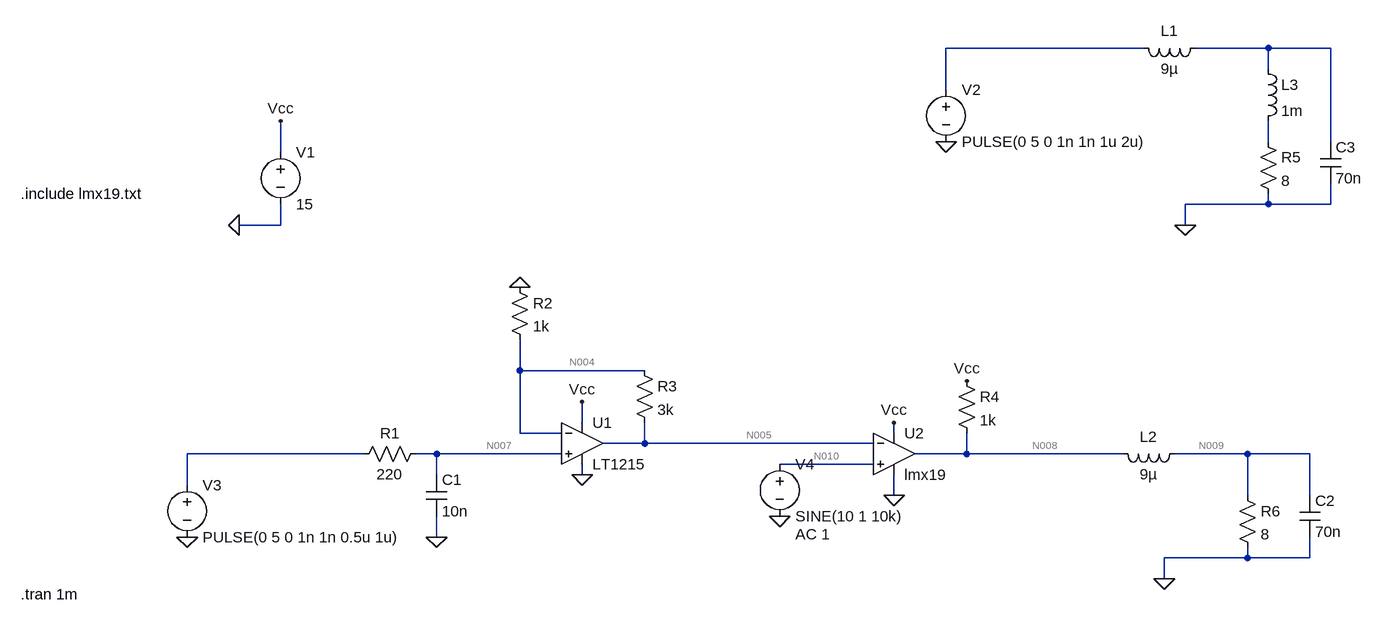
[diagram p0: schematic Entrada-micro-1Mhz - Kopie.asc]
Entrada-micro-1Mhz - Kopie.asc, the LTspice schematic file:
Version 4
SHEET 1 3020 900
WIRE 2272 -288 1968 -288
WIRE 2464 -288 2352 -288
WIRE 2560 -288 2464 -288
WIRE 2464 -256 2464 -288
WIRE 1968 -224 1968 -288
WIRE 2464 -144 2464 -176
WIRE 2560 -144 2560 -288
WIRE 944 -128 944 -176
WIRE 2464 -48 2464 -64
WIRE 2464 -48 2336 -48
WIRE 2560 -48 2560 -80
WIRE 2560 -48 2464 -48
WIRE 944 -16 944 -48
WIRE 944 -16 880 -16
WIRE 2336 -16 2336 -48
WIRE 1312 208 1312 160
WIRE 1504 208 1312 208
WIRE 1408 288 1408 256
WIRE 1312 304 1312 208
WIRE 1376 304 1312 304
WIRE 1888 304 1888 288
WIRE 1504 320 1504 288
WIRE 1504 320 1440 320
WIRE 1856 320 1504 320
WIRE 1072 336 800 336
WIRE 1184 336 1152 336
WIRE 1376 336 1184 336
WIRE 2000 336 2000 304
WIRE 2000 336 1920 336
WIRE 2240 336 2000 336
WIRE 2432 336 2320 336
WIRE 2528 336 2432 336
WIRE 1856 352 1712 352
WIRE 1184 368 1184 336
WIRE 1408 368 1408 352
WIRE 800 384 800 336
WIRE 1888 400 1888 368
WIRE 2432 400 2432 336
WIRE 2528 400 2528 336
WIRE 1184 464 1184 432
WIRE 2432 496 2432 480
WIRE 2432 496 2304 496
WIRE 2528 496 2528 464
WIRE 2528 496 2432 496
WIRE 2304 528 2304 496
FLAG 880 -16 0
FLAG 944 -176 Vcc
FLAG 800 464 0
FLAG 1184 464 0
FLAG 1312 80 0
FLAG 1408 368 0
FLAG 1408 256 Vcc
FLAG 1888 288 Vcc
FLAG 1712 432 0
FLAG 2000 224 Vcc
FLAG 2304 528 0
FLAG 1888 400 0
FLAG 2336 -16 0
FLAG 1968 -144 0
SYMBOL voltage 944 -144 R0
SYMATTR InstName V1
SYMATTR Value 15
SYMBOL voltage 800 368 R0
WINDOW 123 0 0 Left 2
WINDOW 39 0 0 Left 2
SYMATTR InstName V3
SYMATTR Value PULSE(0 5 0 1n 1n 0.5u 1u)
SYMBOL res 1168 320 R90
WINDOW 0 0 56 VBottom 2
WINDOW 3 32 56 VTop 2
SYMATTR InstName R1
SYMATTR Value 220
SYMBOL cap 1168 368 R0
SYMATTR InstName C1
SYMATTR Value 10n
SYMBOL res 1296 64 R0
SYMATTR InstName R2
SYMATTR Value 1k
SYMBOL res 1488 192 R0
SYMATTR InstName R3
SYMATTR Value 3k
SYMBOL Opamps\\LT1215 1408 256 R0
SYMATTR InstName U1
SYMBOL Opamps\\opamp2 1888 272 R0
SYMATTR InstName U2
SYMATTR Value lmx19
SYMBOL voltage 1712 336 R0
WINDOW 123 24 124 Left 2
WINDOW 39 0 0 Left 2
SYMATTR Value2 AC 1
SYMATTR InstName V4
SYMATTR Value SINE(10 1 10k)
SYMBOL res 1984 208 R0
SYMATTR InstName R4
SYMATTR Value 1k
SYMBOL ind 2336 320 R90
WINDOW 0 5 56 VBottom 2
WINDOW 3 32 56 VTop 2
SYMATTR InstName L2
SYMATTR Value 9µ
SYMBOL res 2416 384 R0
SYMATTR InstName R6
SYMATTR Value 8
SYMBOL cap 2512 400 R0
SYMATTR InstName C2
SYMATTR Value 70n
SYMBOL ind 2368 -304 R90
WINDOW 0 5 56 VBottom 2
WINDOW 3 32 56 VTop 2
SYMATTR InstName L1
SYMATTR Value 9µ
SYMBOL res 2448 -160 R0
SYMATTR InstName R5
SYMATTR Value 8
SYMBOL cap 2544 -144 R0
SYMATTR InstName C3
SYMATTR Value 70n
SYMBOL voltage 1968 -240 R0
WINDOW 123 0 0 Left 2
WINDOW 39 0 0 Left 2
SYMATTR InstName V2
SYMATTR Value PULSE(0 5 0 1n 1n 1u 2u)
SYMBOL ind 2448 -272 R0
SYMATTR InstName L3
SYMATTR Value 1m
TEXT 544 -64 Left 2 !.include lmx19.txt
TEXT 544 552 Left 2 !.tran 1m

The netlist it stands for:
* Entrada-micro-1Mhz - Kopie.asc
V1 Vcc 0 15
V3 N006 0 PULSE(0 5 0 1n 1n 0.5u 1u)
R1 N007 N006 220
C1 N007 0 10n
R2 0 N004 1k
R3 N004 N005 3k
XU1 N007 N004 Vcc 0 N005 LT1215  ; pins In+ In- V+ V- OUT
XU2 N010 N005 Vcc 0 N008 lmx19  ; pins In+ In- V+ V- OUT
V4 N010 0 SINE(10 1 10k) AC 1
R4 Vcc N008 1k
L2 N009 N008 9µ
R6 N009 0 8
C2 N009 0 70n
L1 N002 N001 9µ
R5 N003 0 8
C3 N002 0 70n
V2 N001 0 PULSE(0 5 0 1n 1n 1u 2u)
L3 N002 N003 1m
.include lmx19.txt
.tran 1m
.lib LTC.lib
.backanno
.end

* Results of the author's LTspice run, read from the files saved beside the schematic
* Operating Point, zero values left out:
*   V(vcc) = 15 V
*   V(n007) = 100.7 µV
*   V(n004) = 2.137 mV
*   V(n005) = 7.177 mV
*   V(n008) = 119.1 mV
*   V(n010) = 10 V
*   V(n009) = 119 mV
*   I(L2) = -14.88 mA
*   I(R6) = 14.88 mA
*   I(R4) = 14.88 mA
*   I(R3) = -1.68 µA
*   I(R2) = -2.137 µA
*   I(R1) = 457.6 nA
*   I(V3) = 457.6 nA
*   I(V1) = -17.82 mA
*   Ix(u1:1) = -457.6 nA
*   Ix(u1:2) = -457.5 nA
*   Ix(u1:3) = 434.2 µA
*   Ix(u1:4) = -431.8 µA
*   Ix(u1:5) = -1.38 µA
*   Ix(u2:1) = -300 nA
*   Ix(u2:44) = 2.5 mA
*   Ix(u2:55) = -2.5 mA
*   Ix(u2:33) = 992.8 pA